# EAGLE design NodeMCU-11Relays (EAGLE 6.3)
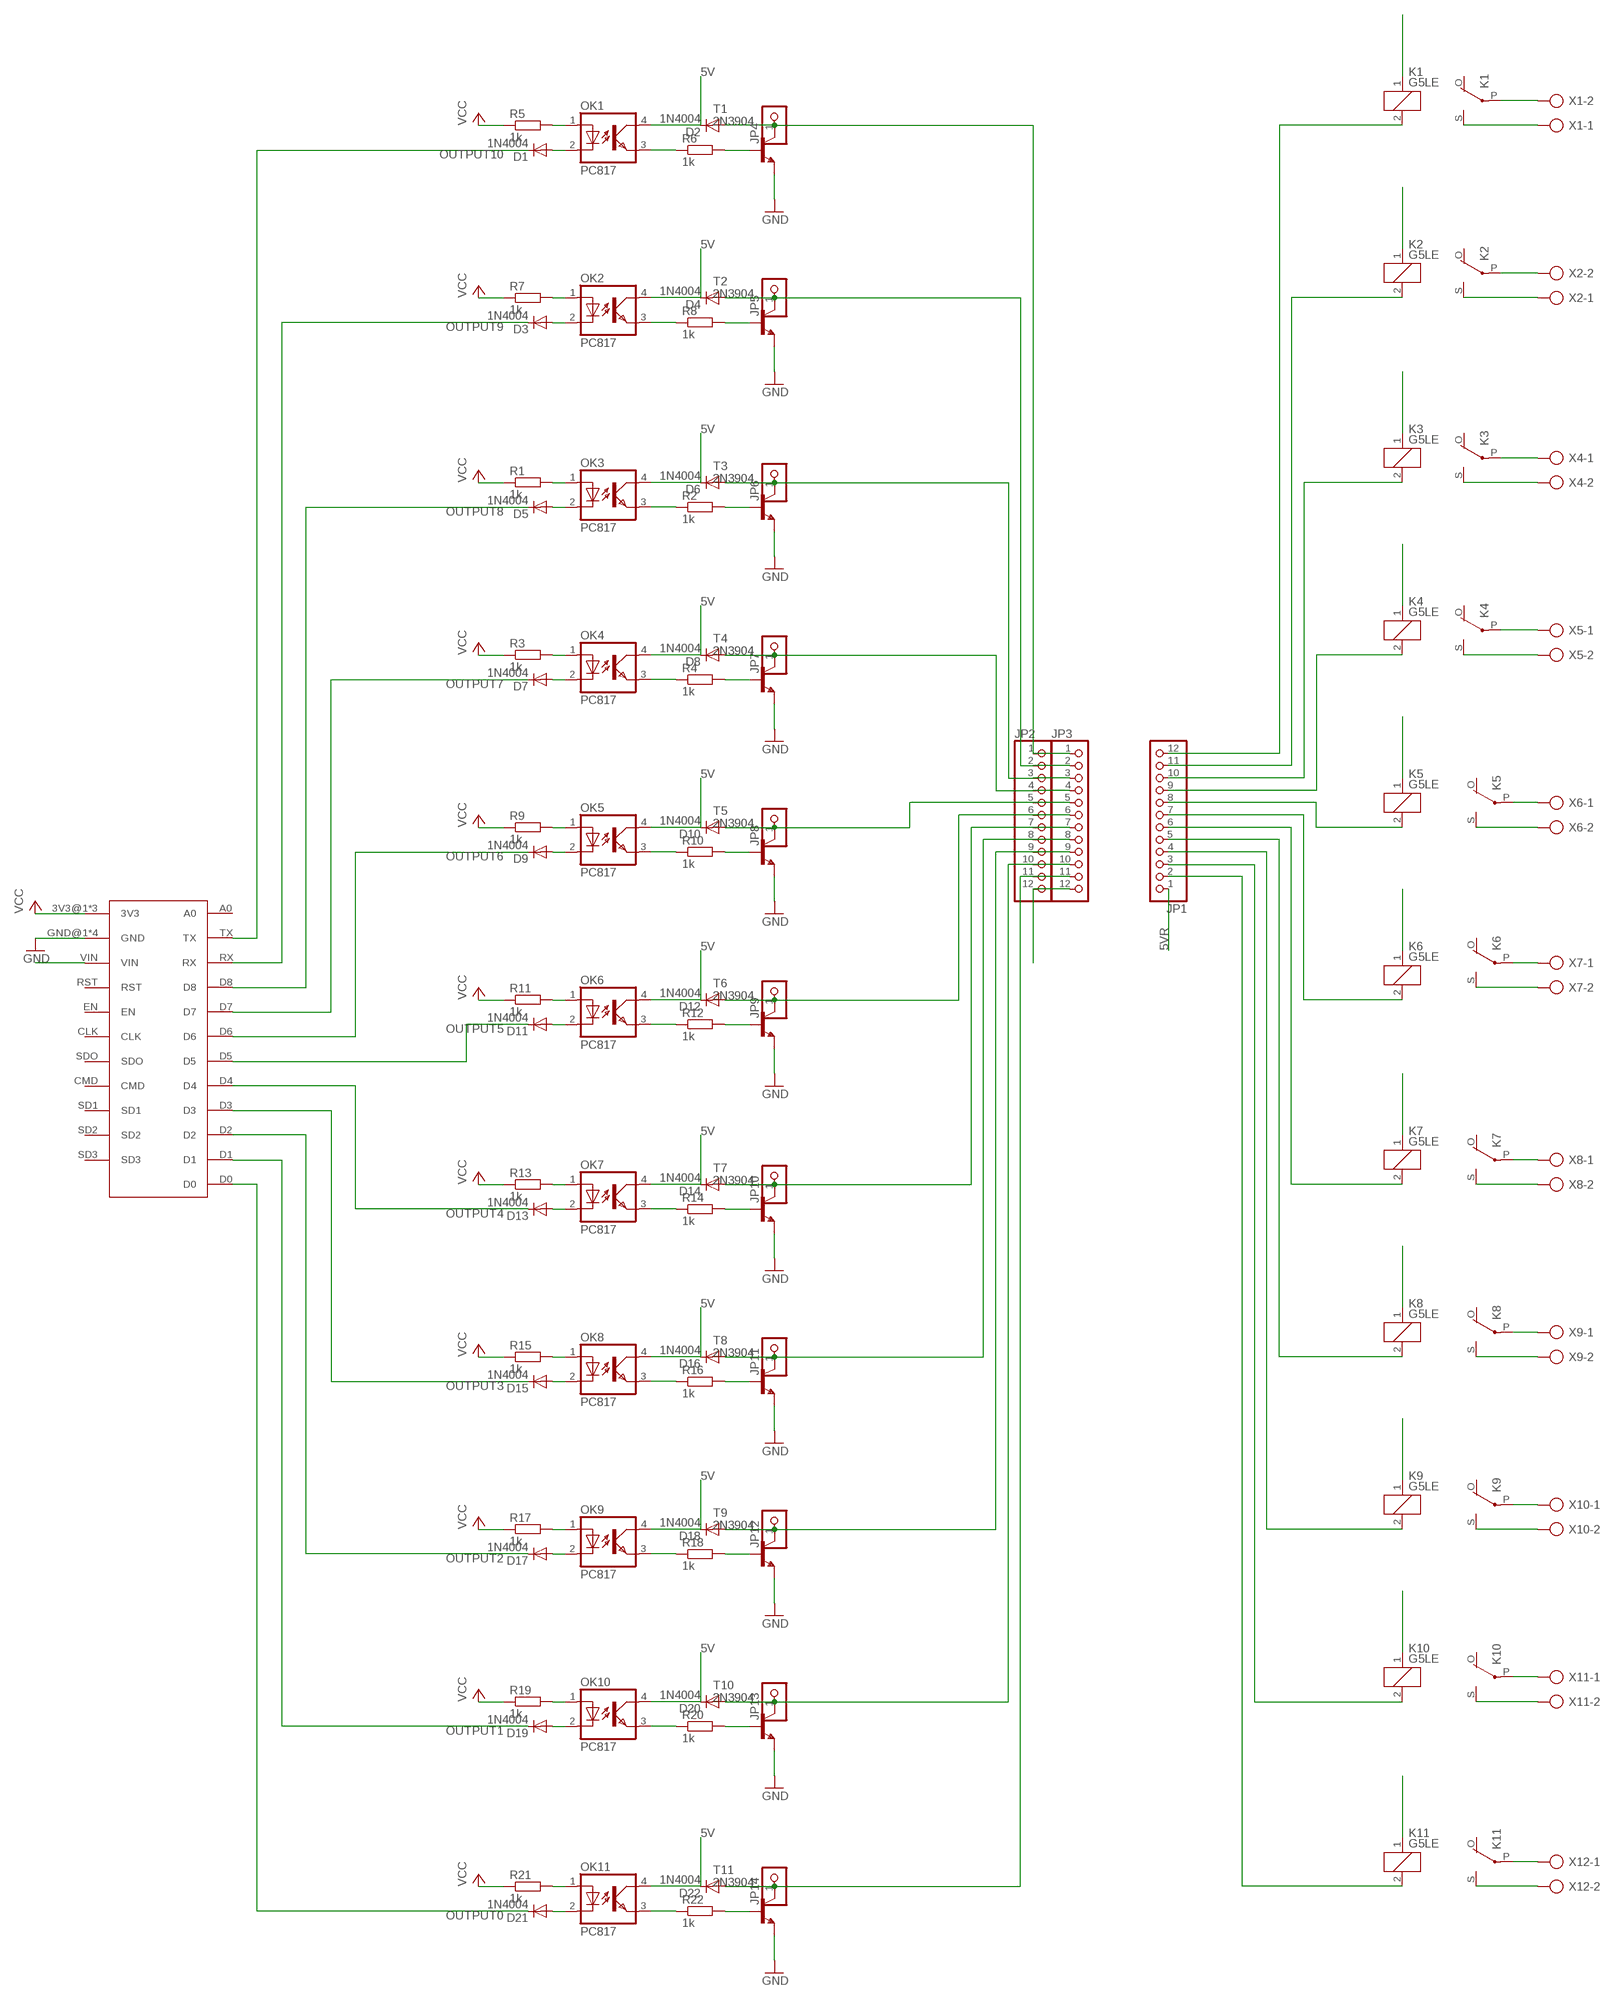
[diagram p0: schematic, sheet 1]

## Parts
D1  1N4004  [DO41-10]
D2  1N4004  [DO41-10]
D3  1N4004  [DO41-10]
D4  1N4004  [DO41-10]
D5  1N4004  [DO41-10]
D6  1N4004  [DO41-10]
D7  1N4004  [DO41-10]
D8  1N4004  [DO41-10]
D9  1N4004  [DO41-10]
D10  1N4004  [DO41-10]
D11  1N4004  [DO41-10]
D12  1N4004  [DO41-10]
D13  1N4004  [DO41-10]
D14  1N4004  [DO41-10]
D15  1N4004  [DO41-10]
D16  1N4004  [DO41-10]
D17  1N4004  [DO41-10]
D18  1N4004  [DO41-10]
D19  1N4004  [DO41-10]
D20  1N4004  [DO41-10]
D21  1N4004  [DO41-10]
D22  1N4004  [DO41-10]
JP1  PINHD-1X12  [1X12]
JP2  PINHD-1X12  [1X12]
JP3  PINHD-1X12  [1X12]
JP4  PINHD-1X1  [1X01]
JP5  PINHD-1X1  [1X01]
JP6  PINHD-1X1  [1X01]
JP7  PINHD-1X1  [1X01]
JP8  PINHD-1X1  [1X01]
JP9  PINHD-1X1  [1X01]
JP10  PINHD-1X1  [1X01]
JP11  PINHD-1X1  [1X01]
JP12  PINHD-1X1  [1X01]
JP13  PINHD-1X1  [1X01]
JP14  PINHD-1X1  [1X01]
K1  G5LE  [G5LE]
K2  G5LE  [G5LE]
K3  G5LE  [G5LE]
K4  G5LE  [G5LE]
K5  G5LE  [G5LE]
K6  G5LE  [G5LE]
K7  G5LE  [G5LE]
K8  G5LE  [G5LE]
K9  G5LE  [G5LE]
K10  G5LE  [G5LE]
K11  G5LE  [G5LE]
OK1  PC817  [DIL04]
OK2  PC817  [DIL04]
OK3  PC817  [DIL04]
OK4  PC817  [DIL04]
OK5  PC817  [DIL04]
OK6  PC817  [DIL04]
OK7  PC817  [DIL04]
OK8  PC817  [DIL04]
OK9  PC817  [DIL04]
OK10  PC817  [DIL04]
OK11  PC817  [DIL04]
R1  1k  R-EU_0207/10  [0207/10]
R2  1k  R-EU_0207/10  [0207/10]
R3  1k  R-EU_0207/10  [0207/10]
R4  1k  R-EU_0207/10  [0207/10]
R5  1k  R-EU_0207/10  [0207/10]
R6  1k  R-EU_0207/10  [0207/10]
R7  1k  R-EU_0207/10  [0207/10]
R8  1k  R-EU_0207/10  [0207/10]
R9  1k  R-EU_0207/10  [0207/10]
R10  1k  R-EU_0207/10  [0207/10]
R11  1k  R-EU_0207/10  [0207/10]
R12  1k  R-EU_0207/10  [0207/10]
R13  1k  R-EU_0207/10  [0207/10]
R14  1k  R-EU_0207/10  [0207/10]
R15  1k  R-EU_0207/10  [0207/10]
R16  1k  R-EU_0207/10  [0207/10]
R17  1k  R-EU_0207/10  [0207/10]
R18  1k  R-EU_0207/10  [0207/10]
R19  1k  R-EU_0207/10  [0207/10]
R20  1k  R-EU_0207/10  [0207/10]
R21  1k  R-EU_0207/10  [0207/10]
R22  1k  R-EU_0207/10  [0207/10]
T1  2N3904  [TO92]
T2  2N3904  [TO92]
T3  2N3904  [TO92]
T4  2N3904  [TO92]
T5  2N3904  [TO92]
T6  2N3904  [TO92]
T7  2N3904  [TO92]
T8  2N3904  [TO92]
T9  2N3904  [TO92]
T10  2N3904  [TO92]
T11  2N3904  [TO92]
U$1  NODEMCU-1.0  [NODEMCU-1.0]
X1  AK500/2-H  [AK500/2-H]
X2  AK500/2-H  [AK500/2-H]
X4  AK500/2-H  [AK500/2-H]
X5  AK500/2-H  [AK500/2-H]
X6  AK500/2-H  [AK500/2-H]
X7  AK500/2-H  [AK500/2-H]
X8  AK500/2-H  [AK500/2-H]
X9  AK500/2-H  [AK500/2-H]
X10  AK500/2-H  [AK500/2-H]
X11  AK500/2-H  [AK500/2-H]
X12  AK500/2-H  [AK500/2-H]

## Nets
5V: D2.C D4.C D6.C D8.C D10.C D12.C D14.C D16.C D18.C D20.C D22.C JP2.12 JP3.12 OK1.4(COL) OK2.4(COL) OK3.4(COL) OK4.4(COL) OK5.4(COL) OK6.4(COL) OK7.4(COL) OK8.4(COL) OK9.4(COL) OK10.4(COL) OK11.4(COL) U$1.VIN
5VR: JP1.1 K1.1 K2.1 K3.1 K4.1 K5.1 K6.1 K7.1 K8.1 K9.1 K11.1
GND: T1.3(E) T2.3(E) T3.3(E) T4.3(E) T5.3(E) T6.3(E) T7.3(E) T8.3(E) T9.3(E) T10.3(E) T11.3(E) U$1.GND@1(GND) U$1.GND@2(GND) U$1.GND@3(GND) U$1.GND@4(GND)
N$1: K1.P(2:P) X1.2
N$2: K1.S(2:S) X1.1
N$3: OK1.1(A) R5.2
N$4: OK1.3(EMIT) R6.1
N$5: D1.A OK1.2(C)
N$6: OK2.1(A) R7.2
N$7: R6.2 T1.2(B)
N$8: D2.A JP2.1 JP3.1 JP4.1 T1.1(C)
N$9: OK2.3(EMIT) R8.1
N$10: D3.A OK2.2(C)
N$11: OK3.1(A) R1.2
N$12: R8.2 T2.2(B)
N$13: D4.A JP2.2 JP3.2 JP5.1 T2.1(C)
N$14: K2.S(2:S) X2.1
N$15: K2.P(2:P) X2.2
N$16: OK3.3(EMIT) R2.1
N$17: D5.A OK3.2(C)
N$18: R2.2 T3.2(B)
N$19: D6.A JP2.3 JP3.3 JP6.1 T3.1(C)
N$20: OK4.1(A) R3.2
N$21: OK4.3(EMIT) R4.1
N$22: D7.A OK4.2(C)
N$23: R4.2 T4.2(B)
N$24: D8.A JP2.4 JP3.4 JP7.1 T4.1(C)
N$25: OK5.1(A) R9.2
N$26: OK5.3(EMIT) R10.1
N$27: D9.A OK5.2(C)
N$28: R10.2 T5.2(B)
N$29: D10.A JP2.5 JP3.5 JP8.1 T5.1(C)
N$30: OK6.1(A) R11.2
N$31: OK6.3(EMIT) R12.1
N$32: D11.A OK6.2(C)
N$33: R12.2 T6.2(B)
N$34: D12.A JP2.6 JP3.6 JP9.1 T6.1(C)
N$35: OK7.1(A) R13.2
N$36: OK7.3(EMIT) R14.1
N$37: D13.A OK7.2(C)
N$38: R14.2 T7.2(B)
N$39: D14.A JP2.7 JP3.7 JP10.1 T7.1(C)
N$40: OK8.1(A) R15.2
N$41: OK8.3(EMIT) R16.1
N$42: D15.A OK8.2(C)
N$43: R16.2 T8.2(B)
N$44: D16.A JP2.8 JP3.8 JP11.1 T8.1(C)
N$45: OK9.1(A) R17.2
N$46: OK9.3(EMIT) R18.1
N$47: D17.A OK9.2(C)
N$48: R18.2 T9.2(B)
N$49: D18.A JP2.9 JP3.9 JP12.1 T9.1(C)
N$50: OK10.1(A) R19.2
N$51: OK10.3(EMIT) R20.1
N$52: D19.A OK10.2(C)
N$53: R20.2 T10.2(B)
N$54: D20.A JP2.10 JP3.10 JP13.1 T10.1(C)
N$55: OK11.1(A) R21.2
N$56: OK11.3(EMIT) R22.1
N$57: D21.A OK11.2(C)
N$58: R22.2 T11.2(B)
N$59: D22.A JP2.11 JP3.11 JP14.1 T11.1(C)
N$60: K3.P(2:P) X4.1
N$61: K4.P(2:P) X5.1
N$62: K5.P(2:P) X6.1
N$63: K6.P(2:P) X7.1
N$64: K7.P(2:P) X8.1
N$65: K8.P(2:P) X9.1
N$66: K9.P(2:P) X10.1
N$67: K10.P(2:P) X11.1
N$68: K11.P(2:P) X12.1
N$69: K3.S(2:S) X4.2
N$70: K4.S(2:S) X5.2
N$71: K5.S(2:S) X6.2
N$72: K6.S(2:S) X7.2
N$73: K7.S(2:S) X8.2
N$74: K8.S(2:S) X9.2
N$75: K9.S(2:S) X10.2
N$76: K10.S(2:S) X11.2
N$77: K11.S(2:S) X12.2
N$78: JP1.2 K11.2
N$79: JP1.3 K10.2
N$80: JP1.4 K9.2
N$81: JP1.5 K8.2
N$82: JP1.6 K7.2
N$83: JP1.7 K6.2
N$84: JP1.8 K5.2
N$85: JP1.9 K4.2
N$86: JP1.10 K3.2
N$87: JP1.11 K2.2
N$88: JP1.12 K1.2
N$89: K10.1
OUTPUT0: D21.C U$1.D0
OUTPUT1: D19.C U$1.D1
OUTPUT2: D17.C U$1.D2
OUTPUT3: D15.C U$1.D3
OUTPUT4: D13.C U$1.D4
OUTPUT5: D11.C U$1.D5
OUTPUT6: D9.C U$1.D6
OUTPUT7: D7.C U$1.D7
OUTPUT8: D5.C U$1.D8
OUTPUT9: D3.C U$1.RX
OUTPUT10: D1.C U$1.TX
VCC: R1.1 R3.1 R5.1 R7.1 R9.1 R11.1 R13.1 R15.1 R17.1 R19.1 R21.1 U$1.3V3@1(3V3) U$1.3V3@2(3V3) U$1.3V3@3(3V3)
Unconnected: K1.O(2:O) K2.O(2:O) K3.O(2:O) K4.O(2:O) K5.O(2:O) K6.O(2:O) K7.O(2:O) K8.O(2:O) K9.O(2:O) K10.O(2:O) K11.O(2:O) U$1.A0 U$1.CLK U$1.CMD U$1.EN U$1.RST U$1.SD1 U$1.SD2 U$1.SD3 U$1.SDO

## Library data of the parts
D1-D22 = diode:1N4004: DIODE general purpose rectifier, 1 A
JP1-JP3 = pinhead:PINHD-1X12: PIN HEADER
JP4-JP14 = pinhead:PINHD-1X1: PIN HEADER
K1-K11 = relay:G5LE: RELAY 1 x switch, 10 A/120 V AC, 8 A/30 V DC, Omron; OC_FARNELL: unknown; OC_NEWARK: unknown
OK1-OK11 = optocoupler:PC817: SHARP OPTO COUPLER; MPN: PC817X4J000F; OC_FARNELL: 9707727; OC_NEWARK: 97K7059
R1-R22 = rcl:R-EU_: RESISTOR, European symbol
T1-T11 = transistor:2N3904: NPN TRANSISTOR
U$1 = Andre:NODEMCU-1.0
X1 X2 X4-X12 = con-ptr500:AK500/2-H: CONNECTOR Aug. 2004 / PTR Meßtechnik: Die Bezeichnung der Serie AK505 wurde geändert. Es handelt sich hierbei um AK500 in horizontaler Ausführung.; OC_FARNELL: unknown; OC_NEWARK: unknown

## Board
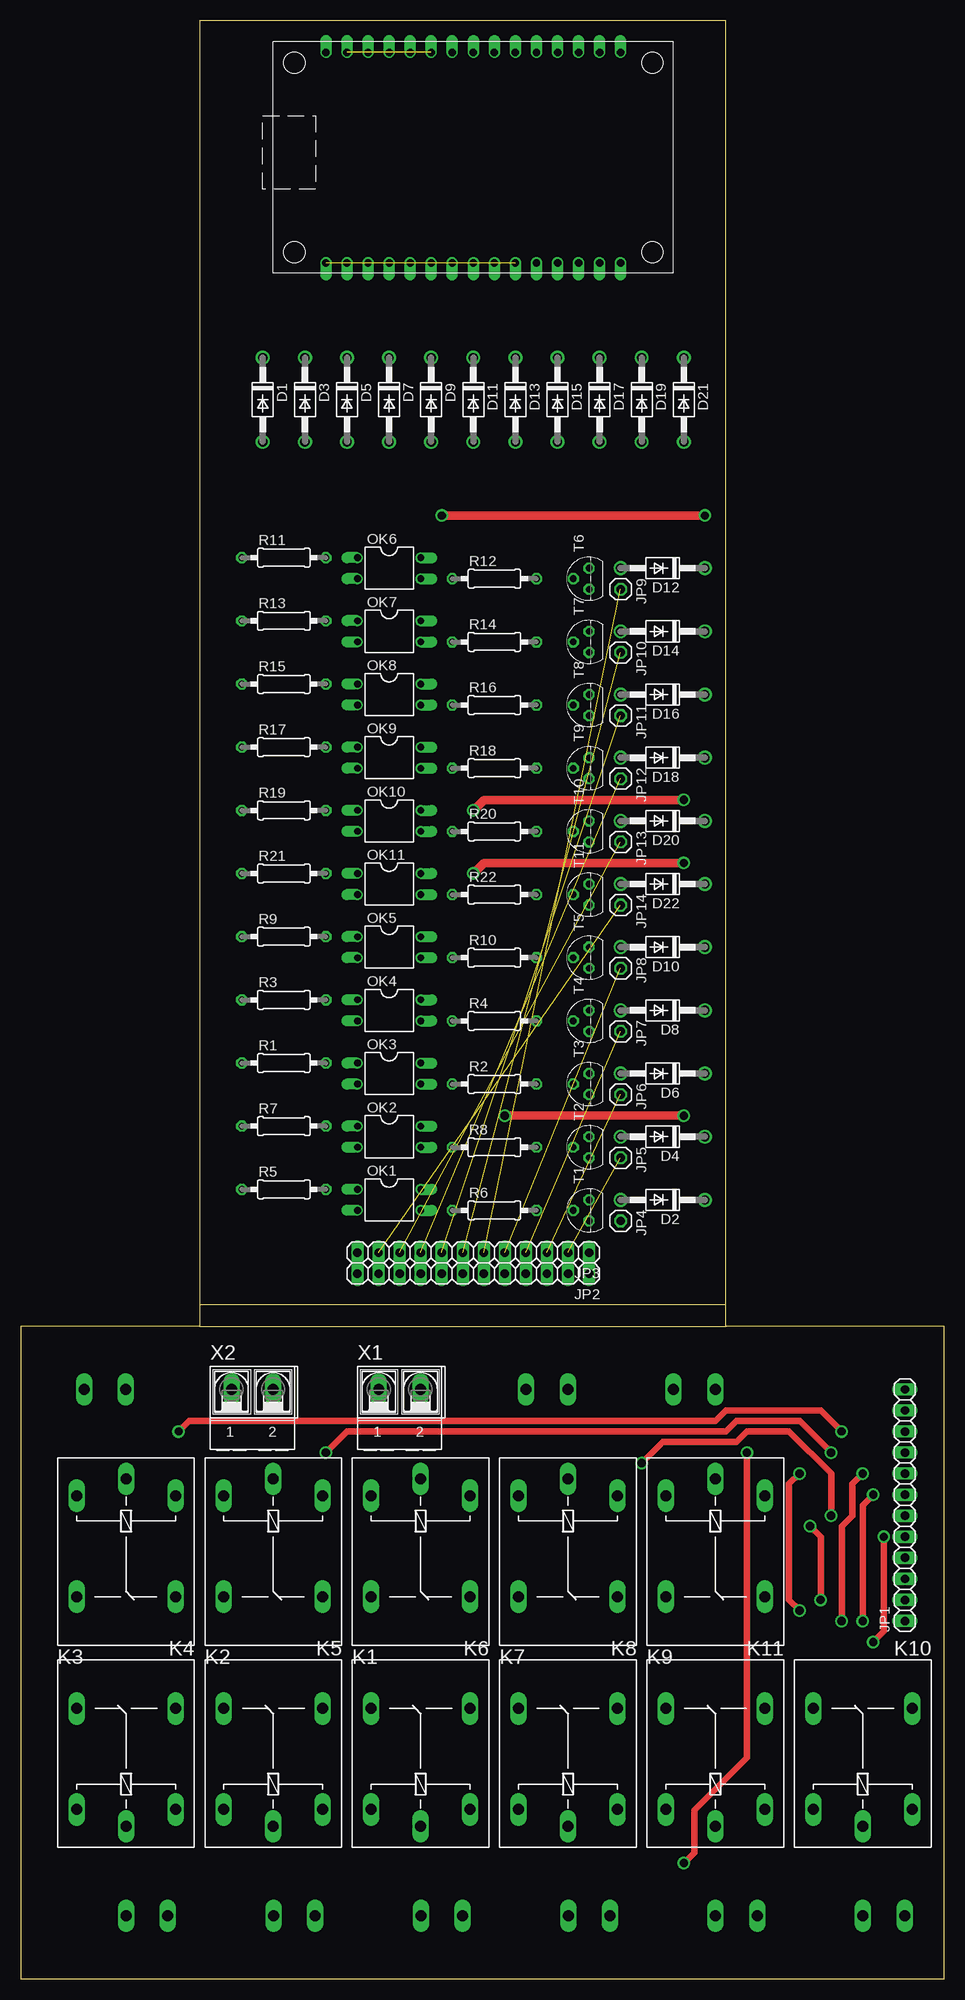
[diagram p1: board, top side]
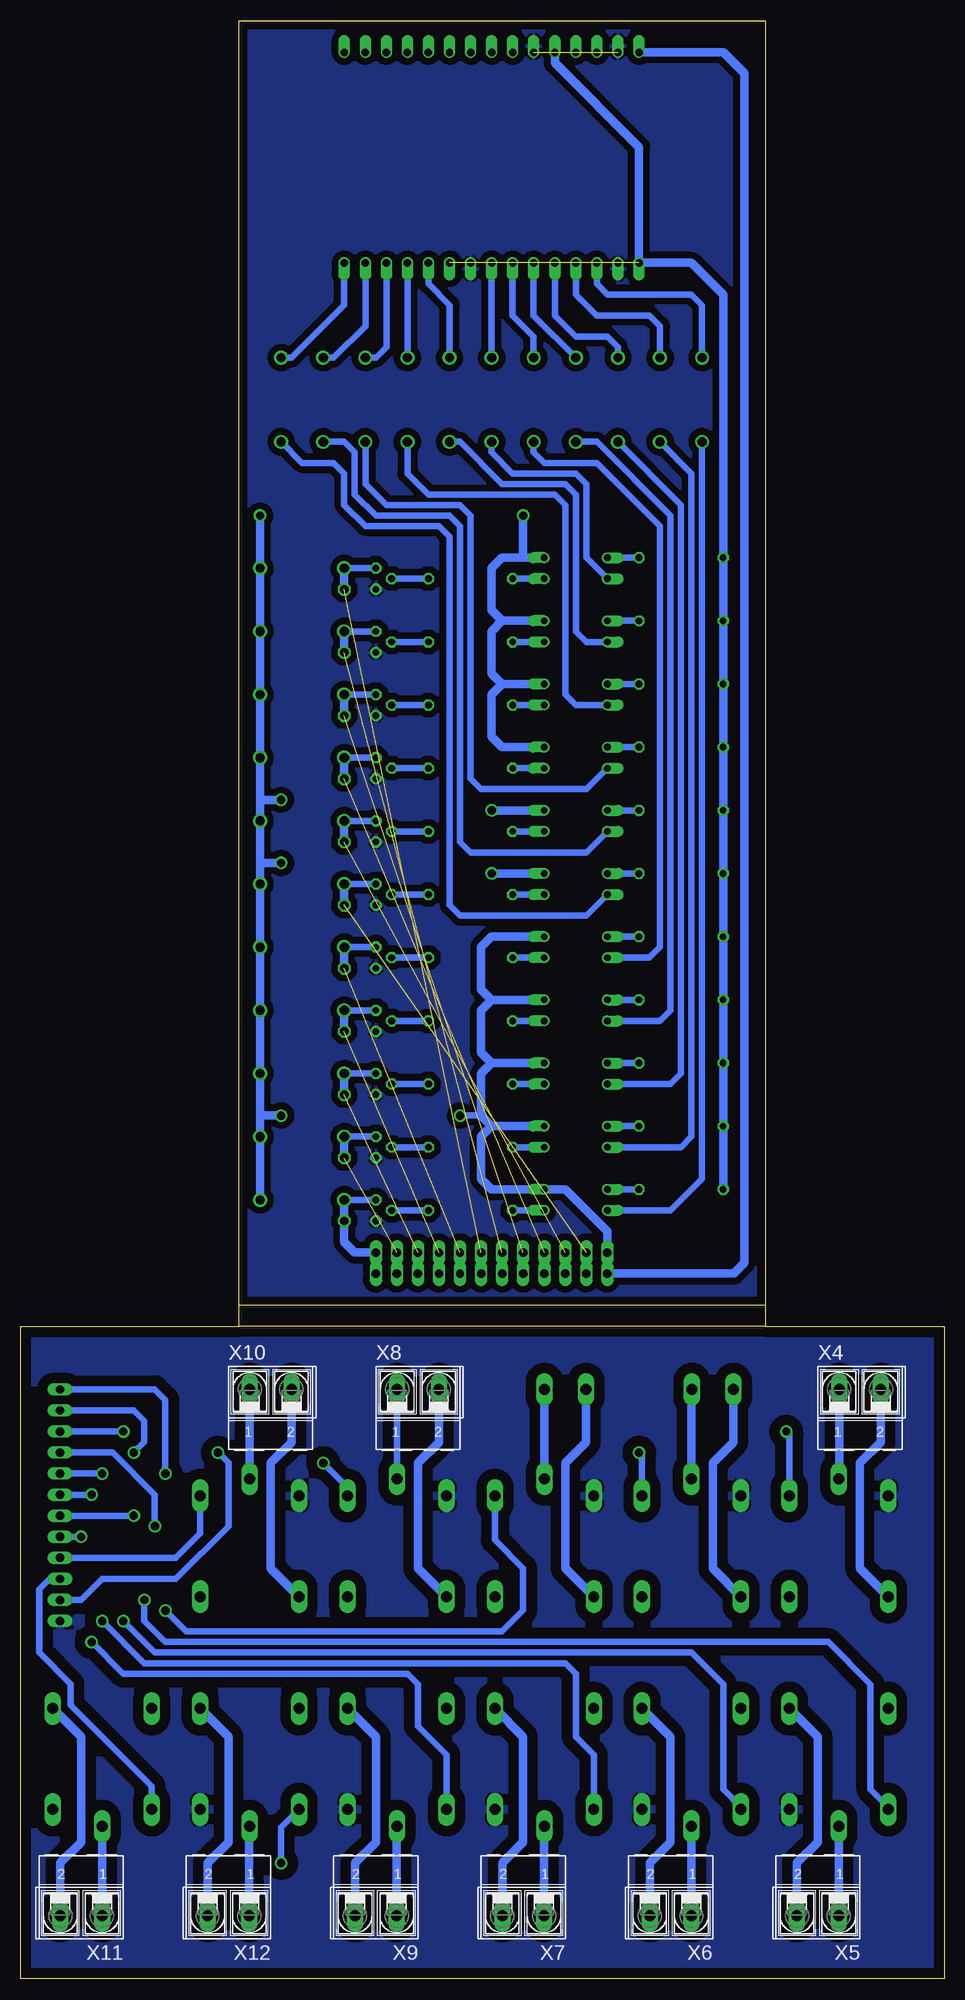
[diagram p2: board, bottom side, seen from below]

Size 111.43 x 236.2 mm. Coordinates in mm from the lower left corner, seen from the top.
Outline: 21.59,81.26 21.59,236.2 85.09,236.2 85.09,81.26
Outline: 21.59,81.26 21.59,78.72
Outline: 21.59,78.72 0,78.72 0,0 111.43,0 111.43,78.72 85.09,78.72
Outline: 85.09,78.72 85.09,81.26
Outline: 85.09,81.26 21.59,81.26
Outline: 21.59,78.72 85.09,78.72
Copper layers (1*16): Top 0.035mm / dielectric 1.5mm / Bottom 0.035mm
Design rules "casa": minimum track width 10mil, minimum drill 24mil, track to track 12mil, track to pad 12mil, pad to pad 12mil, via to via 12mil, smd to smd 12mil, copper to edge 40mil, drill to drill 8mil, minimum pad ring 10mil, minimum via ring 8mil, stop-mask expansion 4mil, vias tented up to drill 0mil, thermal gap 10mil

### Footprints (pad centres in the part's own frame; a part is rotated, then mirrored left to right if it is on the bottom)
DO41-10 = drill 1.118: A 5.08,0; C -5.08,0
1X12 = drill 1.016 long: 1 -13.97,0; 2 -11.43,0; 3 -8.89,0; 4 -6.35,0; 5 -3.81,0; 6 -1.27,0; 7 1.27,0; 8 3.81,0; 9 6.35,0; 10 8.89,0; 11 11.43,0; 12 13.97,0
1X01 = drill 1.016 octagon: 1 0,0
G5LE = drill 1.321 long: 1 -7.493,-5.969; 2 -7.493,5.969; O 4.699,5.969; P -9.525,0; S 4.699,-5.969
DIL04 = drill 0.813 offset: 1 -1.27,-3.81; 2 1.27,-3.81; 3 1.27,3.81; 4 -1.27,3.81
0207/10 = drill 0.813 octagon: 1 -5.08,0; 2 5.08,0
TO92 = drill 0.813 octagon: 1 1.27,0; 2 0,1.905; 3 -1.27,0
NODEMCU-1.0 = drill 0.9 offset: 3V3@1 -12.7,-5.08; 3V3@2 -12.7,17.78; 3V3@3 12.7,7.62; A0 12.7,-17.78; CLK 12.7,2.54; CMD 12.7,-2.54; D0 -12.7,-17.78; D1 -12.7,-15.24; D2 -12.7,-12.7; D3 -12.7,-10.16; D4 -12.7,-7.62; D5 -12.7,0; D6 -12.7,2.54; D7 -12.7,5.08; D8 -12.7,7.62; EN 12.7,10.16; GND@1 -12.7,-2.54; GND@2 -12.7,15.24; GND@3 12.7,5.08; GND@4 12.7,15.24; RST 12.7,12.7; RSV@1 12.7,-15.24; RSV@2 12.7,-12.7; RX -12.7,10.16; SD1 12.7,-5.08; SD2 12.7,-7.62; SD3 12.7,-10.16; SDO 12.7,0; TX -12.7,12.7; VIN 12.7,17.78
AK500/2-H = drill 1.321 long: 1 -2.515,0; 2 2.515,0

### Placement (x,y rotation side)
D1  29.21,190.48 270 top
D2  77.47,93.96 180 top
D3  34.29,190.48 270 top
D4  77.47,101.58 180 top
D5  39.37,190.48 270 top
D6  77.47,109.2 180 top
D7  44.45,190.48 270 top
D8  77.47,116.82 180 top
D9  49.53,190.48 270 top
D10  77.47,124.44 180 top
D11  54.61,190.48 270 top
D12  77.47,170.16 180 top
D13  59.69,190.48 270 top
D14  77.47,162.54 180 top
D15  64.77,190.48 270 top
D16  77.47,154.92 180 top
D17  69.85,190.48 270 top
D18  77.47,147.3 180 top
D19  74.93,190.48 270 top
D20  77.47,139.68 180 top
D21  80.01,190.48 270 top
D22  77.47,132.06 180 top
JP1  106.68,57.13 90 top
JP2  54.61,85.07 180 top
JP3  54.61,87.61 180 top
JP4  72.39,91.42 270 top
JP5  72.39,99.04 270 top
JP6  72.39,106.66 270 top
JP7  72.39,114.28 270 top
JP8  72.39,121.9 270 top
JP9  72.39,167.62 270 top
JP10  72.39,160 270 top
JP11  72.39,152.38 270 top
JP12  72.39,144.76 270 top
JP13  72.39,137.14 270 top
JP14  72.39,129.52 270 top
K1  48.26,50.78 270 top
K2  30.48,50.78 270 top
K3  12.7,50.78 270 top
K4  12.7,27.92 90 top
K5  30.48,27.92 90 top
K6  48.26,27.92 90 top
K7  66.04,50.78 270 top
K8  66.04,27.92 90 top
K9  83.82,50.78 270 top
K10  101.6,27.92 90 top
K11  83.82,27.92 90 top
OK1  44.45,93.96 270 top
OK2  44.45,101.58 270 top
OK3  44.45,109.2 270 top
OK4  44.45,116.82 270 top
OK5  44.45,124.44 270 top
OK6  44.45,170.16 270 top
OK7  44.45,162.54 270 top
OK8  44.45,154.92 270 top
OK9  44.45,147.3 270 top
OK10  44.45,139.68 270 top
OK11  44.45,132.06 270 top
R1  31.75,110.47 0 top
R2  57.15,107.93 0 top
R3  31.75,118.09 0 top
R4  57.15,115.55 0 top
R5  31.75,95.23 0 top
R6  57.15,92.69 0 top
R7  31.75,102.85 0 top
R8  57.15,100.31 0 top
R9  31.75,125.71 0 top
R10  57.15,123.17 0 top
R11  31.75,171.43 0 top
R12  57.15,168.89 0 top
R13  31.75,163.81 0 top
R14  57.15,161.27 0 top
R15  31.75,156.19 0 top
R16  57.15,153.65 0 top
R17  31.75,148.57 0 top
R18  57.15,146.03 0 top
R19  31.75,140.95 0 top
R20  57.15,138.41 0 top
R21  31.75,133.33 0 top
R22  57.15,130.79 0 top
T1  68.58,92.69 90 top
T2  68.58,100.31 90 top
T3  68.58,107.93 90 top
T4  68.58,115.55 90 top
T5  68.58,123.17 90 top
T6  68.58,168.89 90 top
T7  68.58,161.27 90 top
T8  68.58,153.65 90 top
T9  68.58,146.03 90 top
T10  68.58,138.41 90 top
T11  68.58,130.79 90 top
U$1  54.61,219.69 90 top
X1  45.72,71.1 0 top
X2  27.94,71.1 0 top
X4  10.16,71.1 0 bottom
X5  15.24,7.6 180 bottom
X6  33.02,7.6 180 bottom
X7  50.8,7.6 180 bottom
X8  63.5,71.1 0 bottom
X9  68.58,7.6 180 bottom
X10  81.28,71.1 0 bottom
X11  104.14,7.6 180 bottom
X12  86.36,7.6 180 bottom

### Tracks (layer width: path | path; a pad name or v marks a point on that pad's centre or on a via)
5V  (via drill 1)
  Top 1.016: v82.55,176.51 v50.8,176.51 | v54.61,140.95 55.88,142.22 v80.01,142.22 | v54.61,133.33 55.88,134.6 v80.01,134.6 | v58.42,104.12 v80.01,104.12
  Bottom 0.813: 55.88,104.12 v58.42,104.12
  Bottom 1.016: OK6.4 50.8,171.43 | 50.8,171.43 53.34,171.43 54.61,170.16 54.61,165.08 53.34,163.81 | 53.34,163.81 OK7.4 | OK8.4 53.34,156.19 | 53.34,156.19 54.61,157.46 54.61,162.54 53.34,163.81 | OK9.4 53.34,148.57 54.61,149.84 54.61,154.92 53.34,156.19 | D2.C D4.C 82.55,104.12 | 82.55,104.12 D6.C D8.C D10.C D22.C 82.55,134.6 | 82.55,134.6 D20.C 82.55,142.22 | 82.55,142.22 D18.C D16.C D14.C D12.C v82.55,176.51 | OK5.4 54.61,125.71 55.88,124.44 55.88,119.36 54.61,118.09 | 54.61,118.09 OK4.4 | OK3.4 54.61,110.47 | 54.61,110.47 55.88,111.74 55.88,116.82 54.61,118.09 | OK2.4 54.61,102.85 | 54.61,102.85 55.88,104.12 55.88,109.2 54.61,110.47 | 54.61,102.85 55.88,101.58 55.88,96.5 54.61,95.23 OK1.4 45.72,95.23 40.64,90.15 JP3.12 JP2.12 25.4,85.07 24.13,86.34 24.13,229.85 26.67,232.39 U$1.VIN | v50.8,176.51 50.8,171.43 | OK10.4 v54.61,140.95 | v80.01,142.22 82.55,142.22 | OK11.4 v54.61,133.33 | v80.01,134.6 82.55,134.6 | v80.01,104.12 82.55,104.12
5VR
  pour Bottom (isolate 1.27): 0,78.72 0,-0.02 111.76,-0.02 111.76,78.72
GND  (1 unrouted)
  pour Bottom (isolate 0.813): 21.59,236.2 21.59,81.26 85.09,81.26 85.09,236.2
N$1
  Bottom 1.016: X1.2 48.23,60.33 K1.P
N$2
  Bottom 1.016: X1.1 43.2,64.73 45.72,62.21 45.72,49.51 K1.S
N$3
  Bottom 0.813: OK1.1 R5.2
N$4
  Bottom 0.813: OK1.3 R6.1
N$5
  Bottom 0.813: D1.A 29.21,96.5 33.02,92.69 OK1.2
N$6
  Bottom 0.813: OK2.1 R7.2
N$7
  Bottom 0.813: T1.2 R6.2
N$8
  Bottom 0.813: D2.A T1.1 | JP2.1 JP3.1
  Bottom 1.016: D2.A JP4.1 72.39,88.88 71.12,87.61 JP3.1
N$9
  Bottom 0.813: OK2.3 R8.1
N$10
  Bottom 0.813: D3.A 30.48,181.59 30.48,101.58 31.75,100.31 OK2.2
N$11
  Bottom 0.813: OK3.1 R1.2
N$12
  Bottom 0.813: T2.2 R8.2
N$13  (1 unrouted)
  Bottom 0.813: T2.1 D4.A | JP2.2 JP3.2
  Bottom 1.016: JP5.1 D4.A
N$14
  Bottom 1.016: X2.1 25.43,64.73 27.94,62.21 27.94,49.51 K2.S
N$15
  Bottom 1.016: K2.P 30.48,71.08 X2.2
N$16
  Bottom 0.813: R2.1 OK3.3
N$17
  Bottom 0.813: D5.A 31.75,177.78 31.75,109.2 33.02,107.93 OK3.2
N$18
  Bottom 0.813: R2.2 T3.2
N$19  (1 unrouted)
  Bottom 0.813: T3.1 D6.A | JP2.3 JP3.3
  Bottom 1.016: JP6.1 D6.A
N$20
  Bottom 0.813: R3.2 OK4.1
N$21
  Bottom 0.813: R4.1 OK4.3
N$22
  Bottom 0.813: D7.A 41.91,185.4 33.02,176.51 33.02,116.82 34.29,115.55 OK4.2
N$23
  Bottom 0.813: T4.2 R4.2
N$24  (1 unrouted)
  Bottom 0.813: T4.1 D8.A | JP2.4 JP3.4
  Bottom 1.016: JP7.1 D8.A
N$25
  Bottom 0.813: OK5.1 R9.2
N$26
  Bottom 0.813: R10.1 OK5.3
N$27
  Bottom 0.813: D9.A 49.53,184.13 48.26,182.86 41.91,182.86 34.29,175.24 34.29,124.44 35.56,123.17 OK5.2
N$28
  Bottom 0.813: T5.2 R10.2
N$29  (1 unrouted)
  Bottom 0.813: T5.1 D10.A | JP2.5 JP3.5
  Bottom 1.016: JP8.1 D10.A
N$30
  Bottom 0.813: OK6.1 R11.2
N$31
  Bottom 0.813: R12.1 OK6.3
N$32
  Bottom 0.813: D11.A 54.61,184.13 52.07,181.59 44.45,181.59 43.18,180.32 43.18,171.43 OK6.2
N$33
  Bottom 0.813: T6.2 R12.2
N$34  (1 unrouted)
  Bottom 0.813: T6.1 D12.A | JP2.6 JP3.6
  Bottom 1.016: D12.A JP9.1
N$35
  Bottom 0.813: OK7.1 R13.2
N$36
  Bottom 0.813: R14.1 OK7.3
N$37
  Bottom 0.813: D13.A 58.42,185.4 53.34,180.32 45.72,180.32 44.45,179.05 44.45,162.54 43.18,161.27 OK7.2
N$38
  Bottom 0.813: T7.2 R14.2
N$39  (1 unrouted)
  Bottom 0.813: T7.1 D14.A | JP2.7 JP3.7
  Bottom 1.016: D14.A JP10.1
N$40
  Bottom 0.813: OK8.1 R15.2
N$41
  Bottom 0.813: R16.1 OK8.3
N$42
  Bottom 0.813: D15.A 64.77,181.59 62.23,179.05 46.99,179.05 45.72,177.78 45.72,154.92 44.45,153.65 OK8.2
N$43
  Bottom 0.813: T8.2 R16.2
N$44  (1 unrouted)
  Bottom 0.813: T8.1 D16.A | JP2.8 JP3.8
  Bottom 1.016: JP11.1 D16.A
N$45
  Bottom 0.813: OK9.1 R17.2
N$46
  Bottom 0.813: R18.1 OK9.3
N$47
  Bottom 0.813: D17.A 69.85,180.32 67.31,177.78 58.42,177.78 57.15,176.51 57.15,144.76 55.88,143.49 43.18,143.49 OK9.2
N$48
  Bottom 0.813: T9.2 R18.2
N$49  (1 unrouted)
  Bottom 0.813: T9.1 D18.A | JP2.9 JP3.9
  Bottom 1.016: JP12.1 D18.A
N$50
  Bottom 0.813: OK10.1 R19.2
N$51
  Bottom 0.813: R20.1 OK10.3
N$52
  Bottom 0.813: D19.A 72.39,185.4 71.12,184.13 71.12,179.05 68.58,176.51 59.69,176.51 58.42,175.24 58.42,137.14 57.15,135.87 43.18,135.87 OK10.2
N$53
  Bottom 0.813: R20.2 T10.2
N$54  (1 unrouted)
  Bottom 0.813: T10.1 D20.A | JP2.10 JP3.10
  Bottom 1.016: JP13.1 D20.A
N$55
  Bottom 0.813: OK11.1 R21.2
N$56
  Bottom 0.813: R22.1 OK11.3
N$57
  Bottom 0.813: D21.A 77.47,182.86 73.66,182.86 72.39,181.59 72.39,177.78 69.85,175.24 60.96,175.24 59.69,173.97 59.69,129.52 58.42,128.25 43.18,128.25 OK11.2
N$58
  Bottom 0.813: T11.2 R22.2
N$59  (1 unrouted)
  Bottom 0.813: T11.1 D22.A | JP2.11 JP3.11
  Bottom 1.016: JP14.1 D22.A
N$60
  Bottom 1.016: X4.1 12.68,60.96 12.7,60.94 K3.P
N$61
  Bottom 1.016: X5.1 12.72,18.37 K4.P
N$62
  Bottom 1.016: X6.1 30.5,17.73 30.48,17.76 K5.P
N$63
  Bottom 1.016: X7.1 48.28,18.37 K6.P
N$64
  Bottom 0.813: K7.P 66.04,71.08 X8.1
N$65
  Bottom 1.016: X9.1 66.06,18.37 K8.P
N$66
  Bottom 1.016: K9.P 83.82,71.08 X10.1
N$67
  Bottom 1.016: X11.1 101.62,17.73 101.6,17.76 K10.P
N$68
  Bottom 1.016: X12.1 83.84,18.37 K11.P
N$69
  Bottom 1.016: X4.2 7.64,64.73 10.16,62.21 10.16,49.51 K3.S
N$70
  Bottom 1.016: X5.2 17.75,13.97 15.24,16.49 15.24,29.19 K4.S
N$71
  Bottom 1.016: X6.2 35.53,13.97 33.02,16.49 33.02,29.19 K5.S
N$72
  Bottom 1.016: X7.2 53.31,13.97 50.8,16.49 50.8,29.19 K6.S
N$73
  Bottom 1.016: X8.2 60.98,64.73 63.5,62.21 63.5,49.51 K7.S 59.69,45.7
N$74
  Bottom 1.016: X9.2 71.09,13.97 68.58,16.49 68.58,29.19 K8.S
N$75
  Bottom 1.016: X10.2 78.77,64.73 81.28,62.21 81.28,49.51 K9.S
N$76
  Bottom 1.016: X11.2 106.66,13.97 104.14,16.49 104.14,29.19 K10.S
N$77
  Bottom 1.016: X12.2 88.88,13.97 86.36,16.49 86.36,29.19 K11.S
N$78  (via drill 1)
  Top 0.813: v87.63,63.48 87.63,26.65 81.28,20.3 81.28,15.22 v80.01,13.95
  Bottom 0.813: JP1.2 104.14,45.7 101.6,48.24 92.71,48.24 86.36,54.59 86.36,62.21 v87.63,63.48 | v80.01,13.95 80.01,18.27 K11.2
N$79
  Bottom 0.813: K10.2 95.63,23.22 105.41,33 105.41,35.54 109.22,39.35 109.22,46.97 107.95,48.24 JP1.3
N$80
  Bottom 0.813: K9.2 89.79,53.7 92.71,50.78 JP1.4
N$81  (via drill 1)
  Top 0.813: v102.87,40.62 104.14,41.89 v104.14,53.32
  Bottom 0.813: K8.2 60.07,27.03 63.5,30.46 63.5,35.54 64.77,36.81 99.06,36.81 v102.87,40.62 | v104.14,53.32 JP1.5
N$82  (via drill 1)
  Top 0.813: v74.93,62.21 77.47,64.75 86.36,64.75 87.63,66.02 92.71,66.02 97.79,60.94 v97.79,55.86
  Bottom 0.813: K7.2 72.01,59.29 v74.93,62.21 | v97.79,55.86 JP1.6
N$83  (via drill 1)
  Top 0.813: v101.6,43.16 101.6,57.13 v102.87,58.4
  Bottom 0.813: K6.2 42.29,27.03 44.45,29.19 44.45,36.81 45.72,38.08 96.52,38.08 v101.6,43.16 | v102.87,58.4 JP1.7
N$84  (via drill 1)
  Top 0.813: v99.06,43.16 99.06,54.59 100.33,55.86 100.33,59.67 v101.6,60.94
  Bottom 0.813: K5.2 24.51,20.68 26.67,22.84 26.67,35.54 30.48,39.35 95.25,39.35 v99.06,43.16 | v101.6,60.94 JP1.8
N$85  (via drill 1)
  Top 0.813: v96.52,45.7 96.52,53.32 v95.25,54.59
  Bottom 0.813: K4.2 6.48,20.43 | v96.52,45.7 96.52,43.16 93.98,40.62 13.97,40.62 8.89,35.54 8.89,22.84 6.48,20.43 | v95.25,54.59 95.25,58.4 100.33,63.48 JP1.9 | 6.22,20.43 6.48,20.43
N$86  (via drill 1)
  Top 0.813: v19.05,66.02 20.32,67.29 83.82,67.29 85.09,68.56 96.52,68.56 v99.06,66.02
  Bottom 0.813: K3.2 18.67,65.64 v19.05,66.02 | v99.06,66.02 JP1.10
N$87  (via drill 1)
  Top 0.813: v36.83,63.48 39.37,66.02 85.09,66.02 86.36,67.29 93.98,67.29 v97.79,63.48
  Bottom 0.813: K2.2 36.45,63.1 v36.83,63.48 | v97.79,63.48 96.52,64.75 96.52,67.29 97.79,68.56 JP1.11
N$88  (via drill 1)
  Top 0.813: v93.98,44.43 92.71,45.7 92.71,59.67 v93.98,60.94
  Bottom 0.813: K1.2 54.23,52.94 50.8,49.51 50.8,44.43 53.34,41.89 91.44,41.89 v93.98,44.43 | JP1.12 95.25,71.1 93.98,69.83 v93.98,60.94
OUTPUT0
  Bottom 0.813: D21.C 78.74,195.56 72.39,201.91 U$1.D0
OUTPUT1
  Bottom 0.813: D19.C 73.66,195.56 69.85,199.37 U$1.D1
OUTPUT2
  Bottom 0.813: D17.C 68.58,195.56 67.31,196.83 U$1.D2
OUTPUT3
  Bottom 0.813: D15.C U$1.D3
OUTPUT4
  Bottom 0.813: D13.C 59.69,201.91 62.23,204.45 U$1.D4
OUTPUT5
  Bottom 0.813: D11.C U$1.D5
OUTPUT6
  Bottom 0.813: D9.C 49.53,198.1 52.07,200.64 U$1.D6
OUTPUT7
  Bottom 0.813: D7.C 49.53,200.64 U$1.D7
OUTPUT8
  Bottom 0.813: D5.C 39.37,196.83 40.64,198.1 44.45,198.1 46.99,200.64 U$1.D8
OUTPUT9
  Bottom 0.813: U$1.RX 44.45,203.18 41.91,200.64 35.56,200.64 34.29,199.37 D3.C
OUTPUT10
  Bottom 0.813: U$1.TX 41.91,204.45 40.64,203.18 30.48,203.18 29.21,201.91 D1.C
VCC  (1 unrouted)
  Bottom 1.016: R5.1 R7.1 R1.1 R3.1 R9.1 R11.1 R13.1 R15.1 R17.1 R19.1 R21.1 26.67,203.18 30.48,206.99 U$1.3V3@2 36.83,220.96 46.99,231.12 U$1.3V3@3